# EAGLE design Annealer PCB (EAGLE 9.6.2)

## Sheet 1 of 2
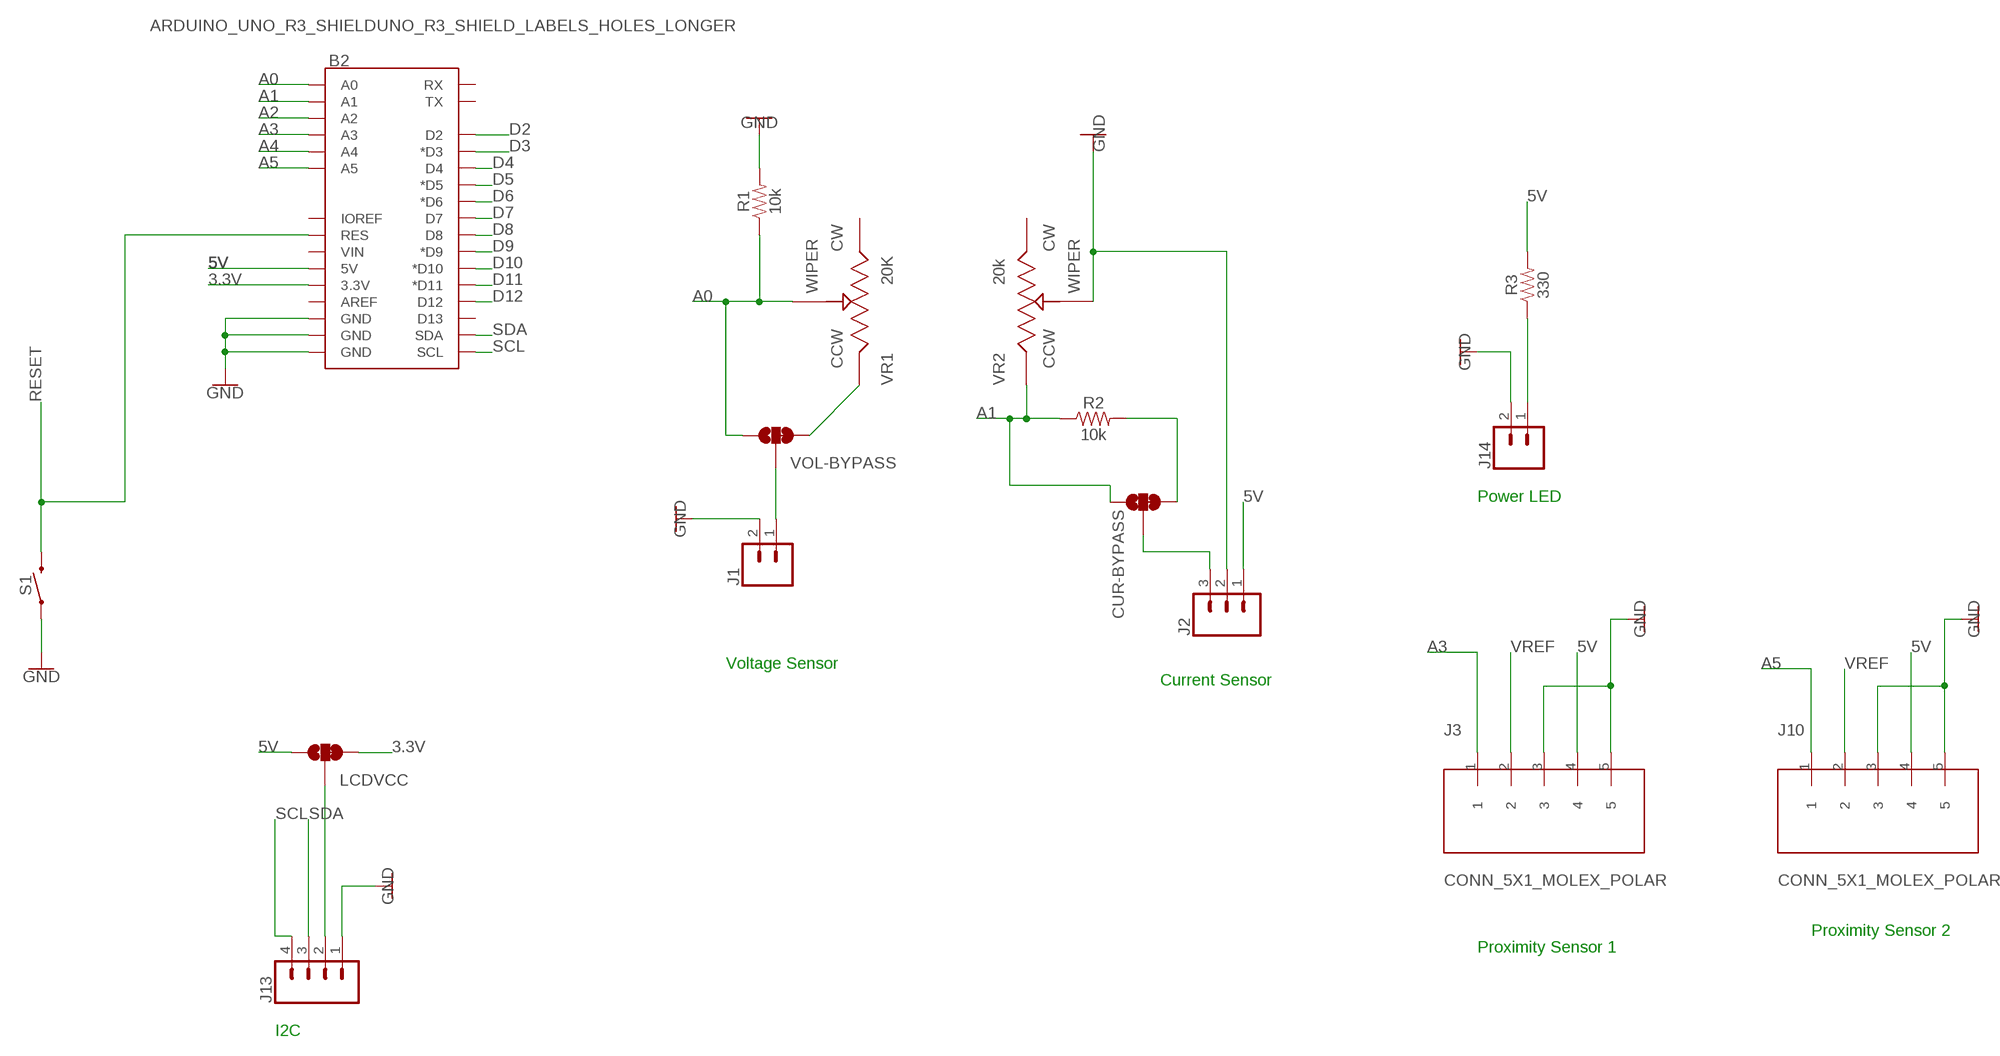
[diagram p0: schematic, sheet 1]

### Parts
B2  ARDUINO_UNO_R3_SHIELDUNO_R3_SHIELD_LABELS_HOLES_LONGER  [UNO_R3_SHIELD_HOLES_LONGER]
CUR-BYPASS  JUMPER-SMT_3_1-NC_TRACE_SILK  [SMT-JUMPER_3_1-NC_TRACE_SILK]
J1  CONN_02POLAR  [MOLEX-1X2]
J2  CONN_03POLAR  [MOLEX-1X3]
J3  CONN_5X1_MOLEX_POLAR  [MOLEX-5]
J10  CONN_5X1_MOLEX_POLAR  [MOLEX-5]
J13  CONN_04POLAR  [MOLEX-1X4]
J14  CONN_02POLAR  [MOLEX-1X2]
LCDVCC  JUMPER-SMT_3_1-NC_TRACE_SILK  [SMT-JUMPER_3_1-NC_TRACE_SILK]
R1  10k  10KOHM-HORIZ-1/4W-1%  [AXIAL-0.3]
R2  10k  10KOHM-HORIZ-1/4W-1%  [AXIAL-0.3]
R3  330  330OHM-HORIZ-1/10W-5%  [AXIAL-0.3]
S1  MOMENTARY-SWITCH-SPST-PTH-6.0MM  [TACTILE_SWITCH_PTH_6.0MM]
VOL-BYPASS  JUMPER-SMT_3_1-NC_TRACE_SILK  [SMT-JUMPER_3_1-NC_TRACE_SILK]
VR1  20K  3296W-1-103LF  [W]
VR2  20k  3296W-1-103LF  [W]

### Nets
3.3V: B2.3.3V LCDVCC.3 ; also sheet 2
5V: B2.5V J2.1 J3.4 J10.4 LCDVCC.1 R3.P$2 ; also sheet 2
A0: B2.A0 R1.P$1 VOL-BYPASS.1 VR1.2
A1: B2.A1 CUR-BYPASS.1 R2.P$1 VR2.1
A2: B2.A2 ; also sheet 2
A3: B2.A3 J3.1
A4: B2.A4 ; also sheet 2
A5: B2.A5 J10.1
D2: B2.D2 ; also sheet 2
D3: B2.D3(*D3) ; also sheet 2
D4: B2.D4 ; also sheet 2
D5: B2.D5(*D5) ; also sheet 2
D6: B2.D6(*D6) ; also sheet 2
D7: B2.D7 ; also sheet 2
D8: B2.D8 ; also sheet 2
D9: B2.D9(*D9) ; also sheet 2
D10: B2.D10(*D10) ; also sheet 2
D11: B2.D11(*D11) ; also sheet 2
D12: B2.D12 ; also sheet 2
GND: B2.GND@0(GND) B2.GND@1(GND) B2.GND@2(GND) J1.2 J2.2 J3.3 J3.5 J10.3 J10.5 J13.1 J14.2 R1.P$2 S1.1 VR2.2 ; also sheet 2
N$1: J14.1 R3.P$1
N$2: CUR-BYPASS.2 J2.3
N$3: CUR-BYPASS.3 R2.P$2
N$4: VOL-BYPASS.3 VR1.1
N$5: J1.1 VOL-BYPASS.2
N$12: J13.2 LCDVCC.2
RESET: B2.RES S1.3
SCL: B2.SCL J13.4
SDA: B2.SDA J13.3
VREF: J3.2 J10.2 ; also sheet 2
Unconnected: B2.AREF B2.D13 B2.IOREF B2.RX B2.TX B2.VIN VR1.3 VR2.3

### Notes on the sheet
- Power LED
- Voltage Sensor
- Current Sensor
- Proximity Sensor 2
- Proximity Sensor 1
- I2C

## Sheet 2 of 2
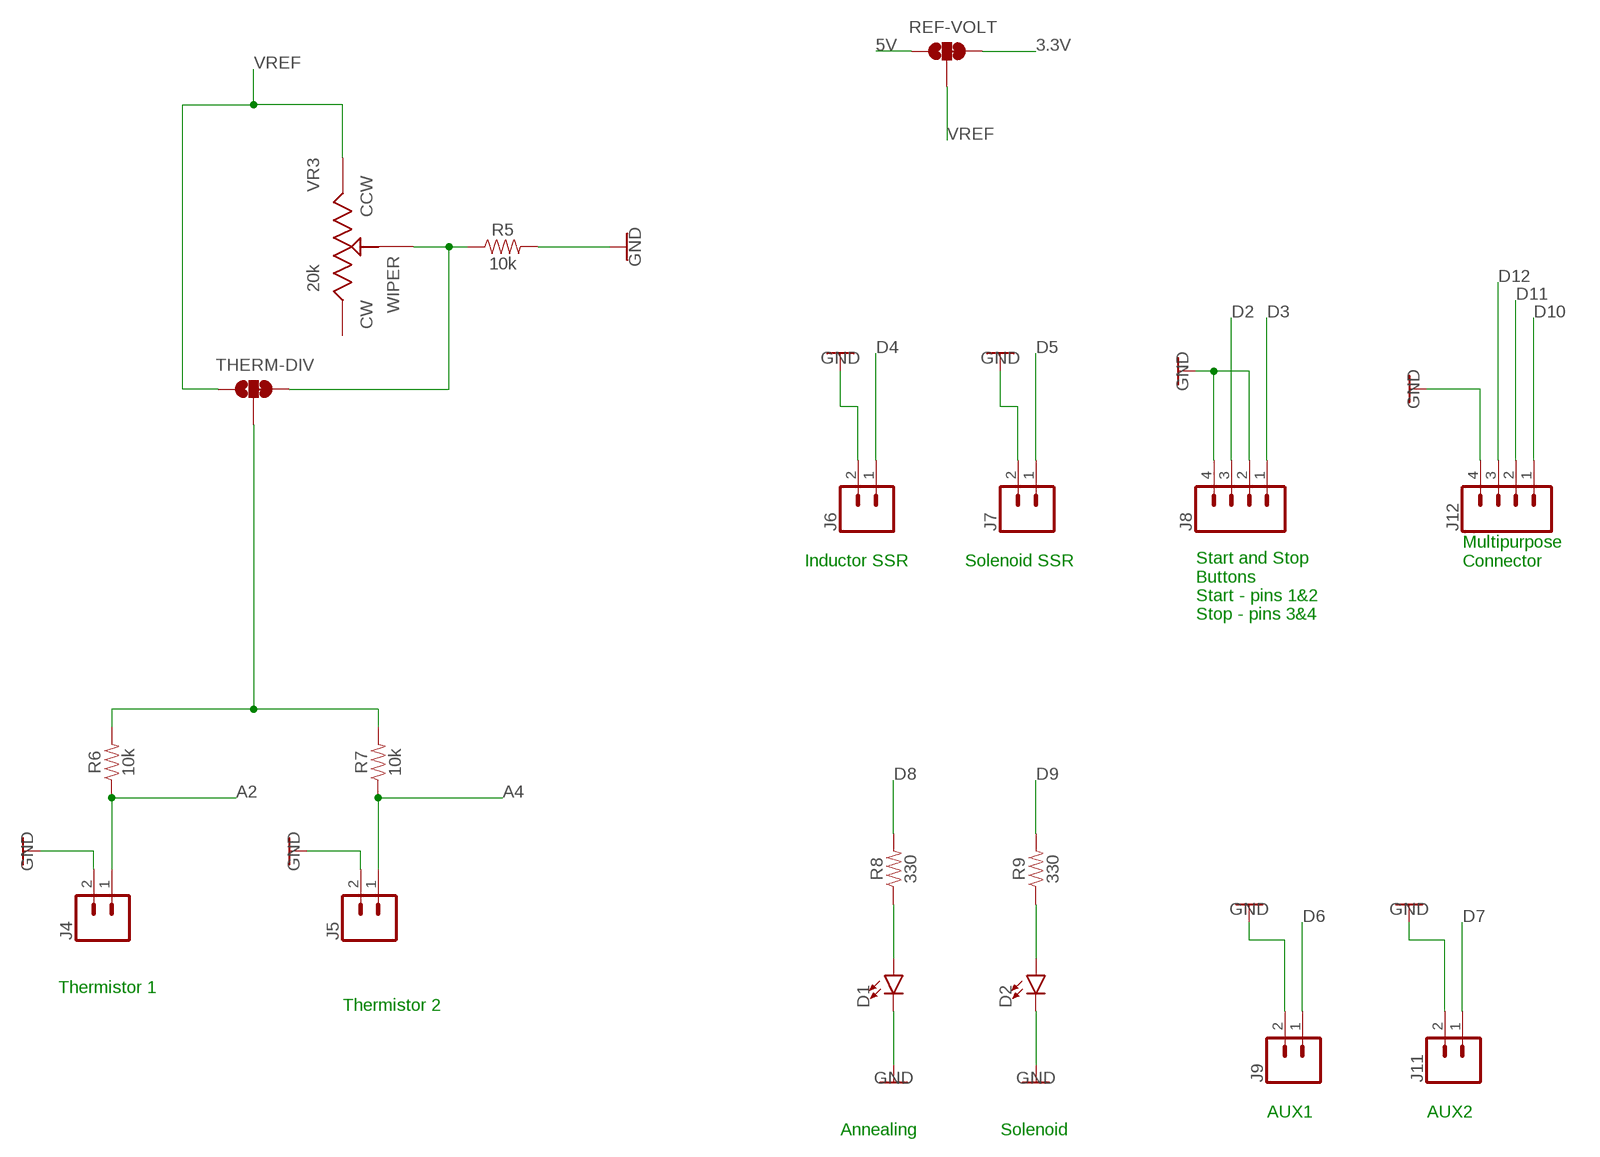
[diagram p1: schematic, sheet 2]

### Parts
D1  LED5MM  [LED_5MM]
D2  LED5MM  [LED_5MM]
J4  CONN_02POLAR  [MOLEX-1X2]
J5  CONN_02POLAR  [MOLEX-1X2]
J6  CONN_02POLAR  [MOLEX-1X2]
J7  CONN_02POLAR  [MOLEX-1X2]
J8  CONN_04POLAR  [MOLEX-1X4]
J9  CONN_02POLAR  [MOLEX-1X2]
J11  CONN_02POLAR  [MOLEX-1X2]
J12  CONN_04POLAR  [MOLEX-1X4]
R5  10k  10KOHM-HORIZ-1/4W-1%  [AXIAL-0.3]
R6  10k  10KOHM-HORIZ-1/4W-1%  [AXIAL-0.3]
R7  10k  10KOHM-HORIZ-1/4W-1%  [AXIAL-0.3]
R8  330  330OHM-HORIZ-1/10W-5%  [AXIAL-0.3]
R9  330  330OHM-HORIZ-1/10W-5%  [AXIAL-0.3]
REF-VOLT  JUMPER-SMT_3_1-NC_TRACE_SILK  [SMT-JUMPER_3_1-NC_TRACE_SILK]
THERM-DIV  JUMPER-SMT_3_1-NC_TRACE_SILK  [SMT-JUMPER_3_1-NC_TRACE_SILK]
VR3  20k  3296W-1-103LF  [W]

### Nets
3.3V: REF-VOLT.3 ; also sheet 1
5V: REF-VOLT.1 ; also sheet 1
A2: J4.1 R6.P$1 ; also sheet 1
A4: J5.1 R7.P$1 ; also sheet 1
D2: J8.3 ; also sheet 1
D3: J8.1 ; also sheet 1
D4: J6.1 ; also sheet 1
D5: J7.1 ; also sheet 1
D6: J9.1 ; also sheet 1
D7: J11.1 ; also sheet 1
D8: R8.P$2 ; also sheet 1
D9: R9.P$2 ; also sheet 1
D10: J12.1 ; also sheet 1
D11: J12.2 ; also sheet 1
D12: J12.3 ; also sheet 1
GND: D1.K(C) D2.K(C) J4.2 J5.2 J6.2 J7.2 J8.2 J8.4 J9.2 J11.2 J12.4 R5.P$2 ; also sheet 1
N$7: D1.A R8.P$1
N$9: D2.A R9.P$1
N$10: R5.P$1 THERM-DIV.3 VR3.2
SRC: R6.P$2 R7.P$2 THERM-DIV.2
VREF: REF-VOLT.2 THERM-DIV.1 VR3.1 ; also sheet 1
Unconnected: VR3.3

### Notes on the sheet
- Inductor SSR | Solenoid SSR
- Multipurpose
  Connector
- Start and Stop
  Buttons
  Start - pins 1&2
  Stop - pins 3&4
- Thermistor 1
- Thermistor 2
- AUX1 | AUX2
- Annealing | Solenoid

## Library data of the parts
B2 = dave-shields:ARDUINO_UNO_R3_SHIELD: Arduino R3 Shield Footprint Shield form compatible with the Arduino Uno R3. SparkFun Products: MG2639 Cellular Shield <https://www.sparkfun.com/products/13120> MIDI Shield <https://www.sparkfun.com/products/12898> R3 Stackable Headers Kit <https://www.sparkfun.com/products/11417>
CUR-BYPASS LCDVCC REF-VOLT THERM-DIV VOL-BYPASS = SparkFun-Jumpers:JUMPER-SMT_3_1-NC_TRACE: Normally closed trace jumper (1 of 2 connections) This jumper has a trace between two pads so it's normally closed (NC). The other connection is normally open (NO). Use a razor knife to open the connection. For best results follow the IPC guidelines for cutting traces: Cutout at least 0.063 mm (0.005 in). Remove all loose material to clean up the cut area. Seal the cut with an approved epoxy. Reapply solder to reclose the connection, or to close the NO connection.
D1 D2 = SparkFun-LED:LED: LED (Generic) Standard schematic elements and footprints for 5mm, 3mm, 1206, and 0603 sized LEDs. Generic LEDs with no color specified.
J1 J4-J7 J9 J11 J14 = SparkFun-Connectors:CONN_02: Multi connection point. Often used as Generic Header-pin footprint for 0.1 inch spaced/style header connections On any of the 0.1 inch spaced packages, you can populate with these: Break Away Headers - Straight <https://www.sparkfun.com/products/116> (PRT-00116) Break Away Male Headers - Right Angle <https://www.sparkfun.com/products/553> (PRT-00553) Female Headers <https://www.sparkfun.com/products/115> (PRT-00115) Break Away Headers - Machine Pin <https://www.sparkfun.com/products/117> (PRT-00117) Break Away Female Headers - Swiss Machine Pin <https://www.sparkfun.com/products/743> (PRT-00743) For SCREWTERMINALS and SPRING TERMINALS visit here: Screw Terimnals on SparkFun.com <https://www.sparkfun.com/search/results?term=Screw+Terminals> (5mm/3.5mm/2.54mm spacing) This device is also useful as a general connection point to wire up your design to another part of your project. Our various solder wires solder well into these plated through hole pads. Hook-Up Wire - Assortment (Stranded, 22 AWG) <https://www.sparkfun.com/products/11375> (PRT-11375) Hook-Up Wire - Assortment (Solid Core, 22 AWG) <https://www.sparkfun.com/products/11367> (PRT-11367) View the entire wire category on our website here <https://www.sparkfun.com/categories/141> Special notes: Molex polarized connector foot print use with: PRT-08233 with associated crimp pins and housings. 2.54_SCREWTERM for use with PRT-10571. 3.5mm Screw Terminal footprints for PRT-08084 5mm Screw Terminal footprints for use with PRT-08432; SF_ID: PRT-09918
J2 = SparkFun-Connectors:CONN_03: Multi connection point. Often used as Generic Header-pin footprint for 0.1 inch spaced/style header connections On any of the 0.1 inch spaced packages, you can populate with these: Break Away Headers - Straight <https://www.sparkfun.com/products/116> (PRT-00116) Break Away Male Headers - Right Angle <https://www.sparkfun.com/products/553> (PRT-00553) Female Headers <https://www.sparkfun.com/products/115> (PRT-00115) Break Away Headers - Machine Pin <https://www.sparkfun.com/products/117> (PRT-00117) Break Away Female Headers - Swiss Machine Pin <https://www.sparkfun.com/products/743> (PRT-00743) Stackable Header - 3 Pin (Female, 0.1") <https://www.sparkfun.com/products/13875> (PRT-13875) For SCREWTERMINALS and SPRING TERMINALS visit here: Screw Terimnals on SparkFun.com <https://www.sparkfun.com/search/results?term=Screw+Terminals> (5mm/3.5mm/2.54mm spacing) This device is also useful as a general connection point to wire up your design to another part of your project. Our various solder wires solder well into these plated through hole pads. Hook-Up Wire - Assortment (Stranded, 22 AWG) <https://www.sparkfun.com/products/11375> (PRT-11375) Hook-Up Wire - Assortment (Solid Core, 22 AWG) <https://www.sparkfun.com/products/11367> (PRT-11367) View the entire wire category on our website here <https://www.sparkfun.com/categories/141> Special notes: Molex polarized connector foot print use with SKU : PRT-08232 with associated crimp pins and housings.; PROD_ID: CONN-08625; SF_ID: PRT-08096
J3 J10 = dave-connectors:CONN_5X1_MOLEX_POLAR
J8 J12 J13 = SparkFun-Connectors:CONN_04: Multi connection point. Often used as Generic Header-pin footprint for 0.1 inch spaced/style header connections On any of the 0.1 inch spaced packages, you can populate with these: Break Away Headers - Straight <https://www.sparkfun.com/products/116> (PRT-00116) Break Away Male Headers - Right Angle <https://www.sparkfun.com/products/553> (PRT-00553) Female Headers <https://www.sparkfun.com/products/115> (PRT-00115) Break Away Headers - Machine Pin <https://www.sparkfun.com/products/117> (PRT-00117) Break Away Female Headers - Swiss Machine Pin <https://www.sparkfun.com/products/743> (PRT-00743) For SCREWTERMINALS and SPRING TERMINALS visit here: Screw Terimnals on SparkFun.com <https://www.sparkfun.com/search/results?term=Screw+Terminals> (5mm/3.5mm/2.54mm spacing) This device is also useful as a general connection point to wire up your design to another part of your project. Our various solder wires solder well into these plated through hole pads. Hook-Up Wire - Assortment (Stranded, 22 AWG) <https://www.sparkfun.com/products/11375> (PRT-11375) Hook-Up Wire - Assortment (Solid Core, 22 AWG) <https://www.sparkfun.com/products/11367> (PRT-11367) View the entire wire category on our website here <https://www.sparkfun.com/categories/141> Special notes: Molex polarized connector foot print use with SKU : PRT-08231 with associated crimp pins and housings. 1MM SMD Version SKU: PRT-10208; PROD_ID: CONN-08186; SF_ID: PRT-08231
R1 R2 R5-R7 = SparkFun-Resistors:10KOHM: 10kΩ resistor A resistor is a passive two-terminal electrical component that implements electrical resistance as a circuit element. Resistors act to reduce current flow, and, at the same time, act to lower voltage levels within circuits. - Wikipedia; PROD_ID: RES-12183
R3 R8 R9 = SparkFun-Resistors:330OHM: 330Ω resistor A resistor is a passive two-terminal electrical component that implements electrical resistance as a circuit element. Resistors act to reduce current flow, and, at the same time, act to lower voltage levels within circuits. - Wikipedia; PROD_ID: RES-8371
S1 = SparkFun-Switches:MOMENTARY-SWITCH-SPST: Momentary Switch (Pushbutton) - SPST Normally-open (NO) SPST momentary switches (buttons, pushbuttons). Variants PTH-12MM - 12mm square, through-hole Momentary Pushbutton Switch - 12mm Square <https://www.sparkfun.com/products/9190> (COM-09190) PTH-6.0MM, PTH-6.0MM-KIT - 6.0mm square, through-hole Mini Pushbutton Switch <https://www.sparkfun.com/products/97> (COM-00097) KIT package intended for soldering kit's - only one side of pads' copper is exposed. PTH-RIGHT-ANGLE-KIT - Right-angle, through-hole Right Angle Tactile Button <https://www.sparkfun.com/products/10791> - Used on SparkFun BigTime Watch Kit <https://www.sparkfun.com/products/11734> SMD-12MM - 12mm square, surface-mount Tactile Button - SMD (12mm) <https://www.sparkfun.com/products/12993> (COM-12993) Used on SparkFun PicoBoard <https://www.sparkfun.com/products/11888> SMD-4.5MM - 4.5mm Square Trackball Switch Used on SparkFun Blackberry Trackballer Breakout <https://www.sparkfun.com/products/13169> SMD-4.6MMX2.8MM - 4.60mm x 2.80mm, surface mount Used on SparkFun SAMD21 Mini Breakout <https://www.sparkfun.com/products/13664> SMD-5.2MM, SMD-5.2-REDUNDANT - 5.2mm square, surface-mount Mini Pushbutton Switch - SMD <https://www.sparkfun.com/products/8720> (COM-08720) Used on Arduino Pro Mini <https://www.sparkfun.com/products/11114> REDUNDANT package connects both switch circuits together SMD-6.0X3.5MM - 6.0 x 3.5mm, surface mount Momentary Reset Switch SMD <https://www.sparkfun.com/products/8229> (COM-08229) SMD-6.2MM-TALL - 6.2mm square, surface mount Tactile Button - SMD (6mm) <https://www.sparkfun.com/products/12992> Used on SparkFun Digital Sandbox <https://www.sparkfun.com/products/12651> SMD-RIGHT-ANGLE - Right-angle, surface mount Used on SparkFun Block for Intel® Edison - Arduino <https://www.sparkfun.com/products/13036>; PROD_ID: SWCH-08441; SF_SKU: COM-00097
VR1-VR3 = Volks73-Bourns:3296?-*: Trim Potentiometer (Pot) Documentation Datasheet <http://www.bourns.com/data/global/pdfs/3296.pdf> Features Multiturn/Cermet/Industrial/Sealed 5 terminal styles Tape and reel packaging Chevron seal design Listed on the QPL for style RJ24 per MIL-R_22097 and RJR24 per High-Rel Mil-R-39035 Mounting hardware available (H-117P) RoHS compliant* version available For trimmer applications/processing guidelines, click here <http://www.bourns.com/data/global/pdfs/ap_proc.pdf>; ADJUSTMENT_TYPE: Tope Adjustment; CATEGORY: Potentiometers, Variable Resistors; DESCRIPTION: TRIMMER 10K OHM 0.5W PC PIN; DOCUMENTATION_LINK: <a href="http://www.bourns.com/data/global/pdfs/3296.pdf">Datasheet</a>; DOCUMENTATION_URL: http://www.bourns.com/data/global/pdfs/3296.pdf; FAMILY: Trimmer Potentiometers; MANUFACTURER: Bourns Inc; MOUNTING_TYPE: Through Hole; NUMBER_OF_TURNS: 25; PART_NUMBER: 3296W-1-103LF; POWER: 0.5W, 1/2W; RESISTANCE: 10k; RESISTIVE_MATERIAL: Cermet; SERIES: Trimpt 3296 - Sealed; SIZE: Rectangular - 0.375" x 0.190" Face x 0.395" H (9.53mm x 4.83mm x 10.03mm); STANDARD_PACKAGE: 50; SUPPLIER_ITEM_LINK: <a href="http://www.digikey.com/product-detail/en/3296W-1-103LF/3296W-103LF-ND/1088045">Details</a>; SUPPLIER_ITEM_NUMBER: 3296W-103LF-ND; SUPPLIER_ITEM_URL: http://www.digikey.com/product-detail/en/3296W-1-103LF/3296W-103LF-ND/1088045; SUPPLIER_LINK: <a href="http://www.digikey.com">Home Page</a>; SUPPLIER_NAME: Digi-Key; SUPPLIER_URL: http://www.digikey.com; TEMPERATURE_COEFFICIENT: 100ppm/C; TERMINATION_STYLE: PC Pin; TOLERANCE: 10%

## Net classes
1 power: width 0.254 mm, clearance 0.205 mm to class 0, clearance 0.205 mm

## Board
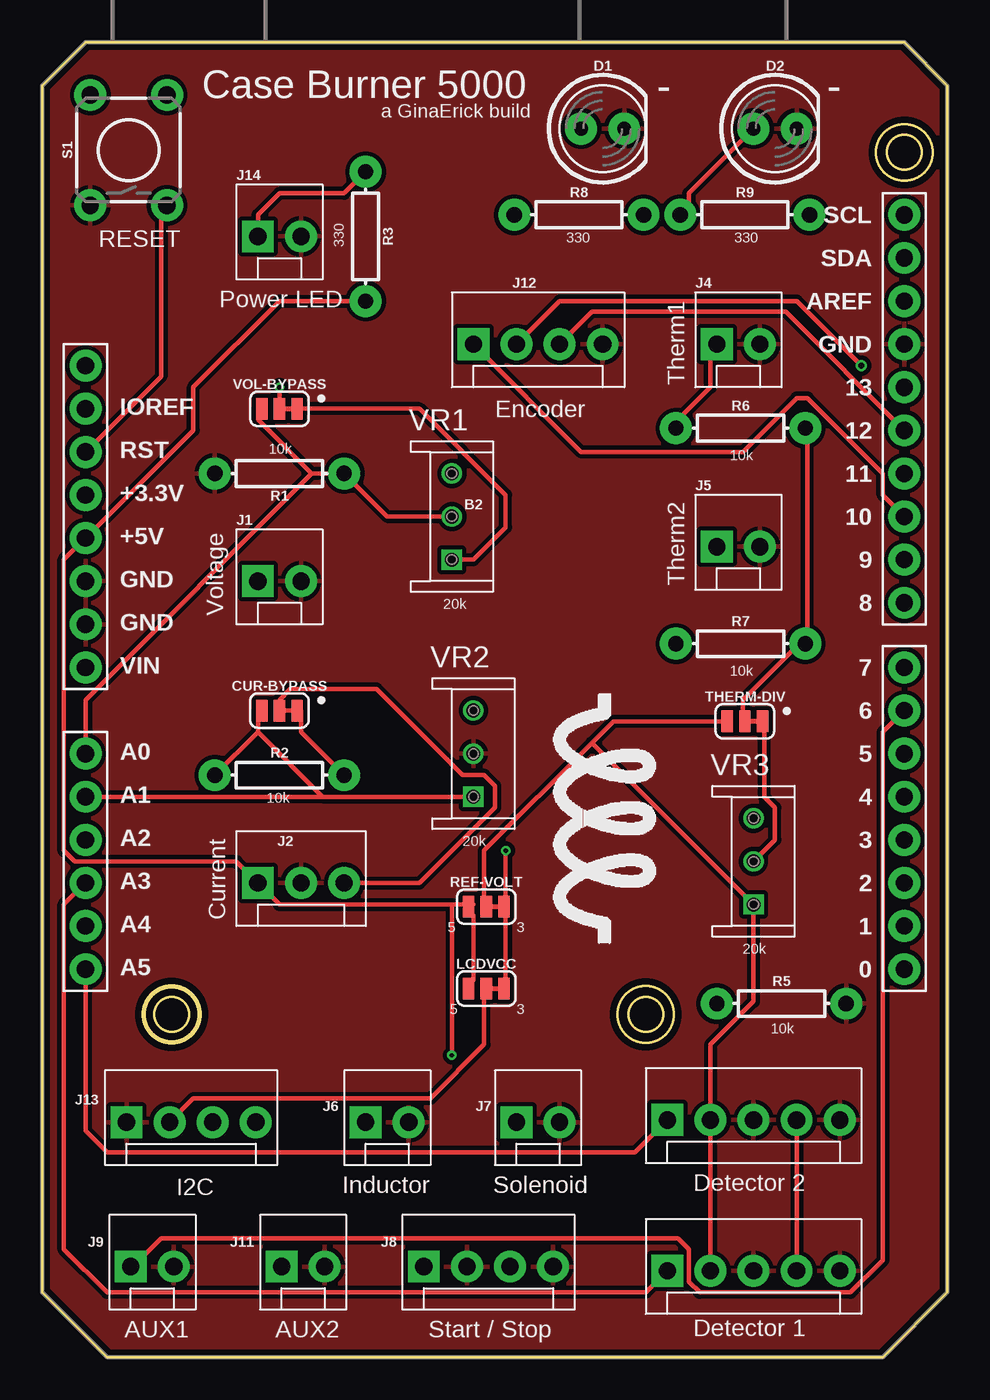
[diagram p2: board, top side]
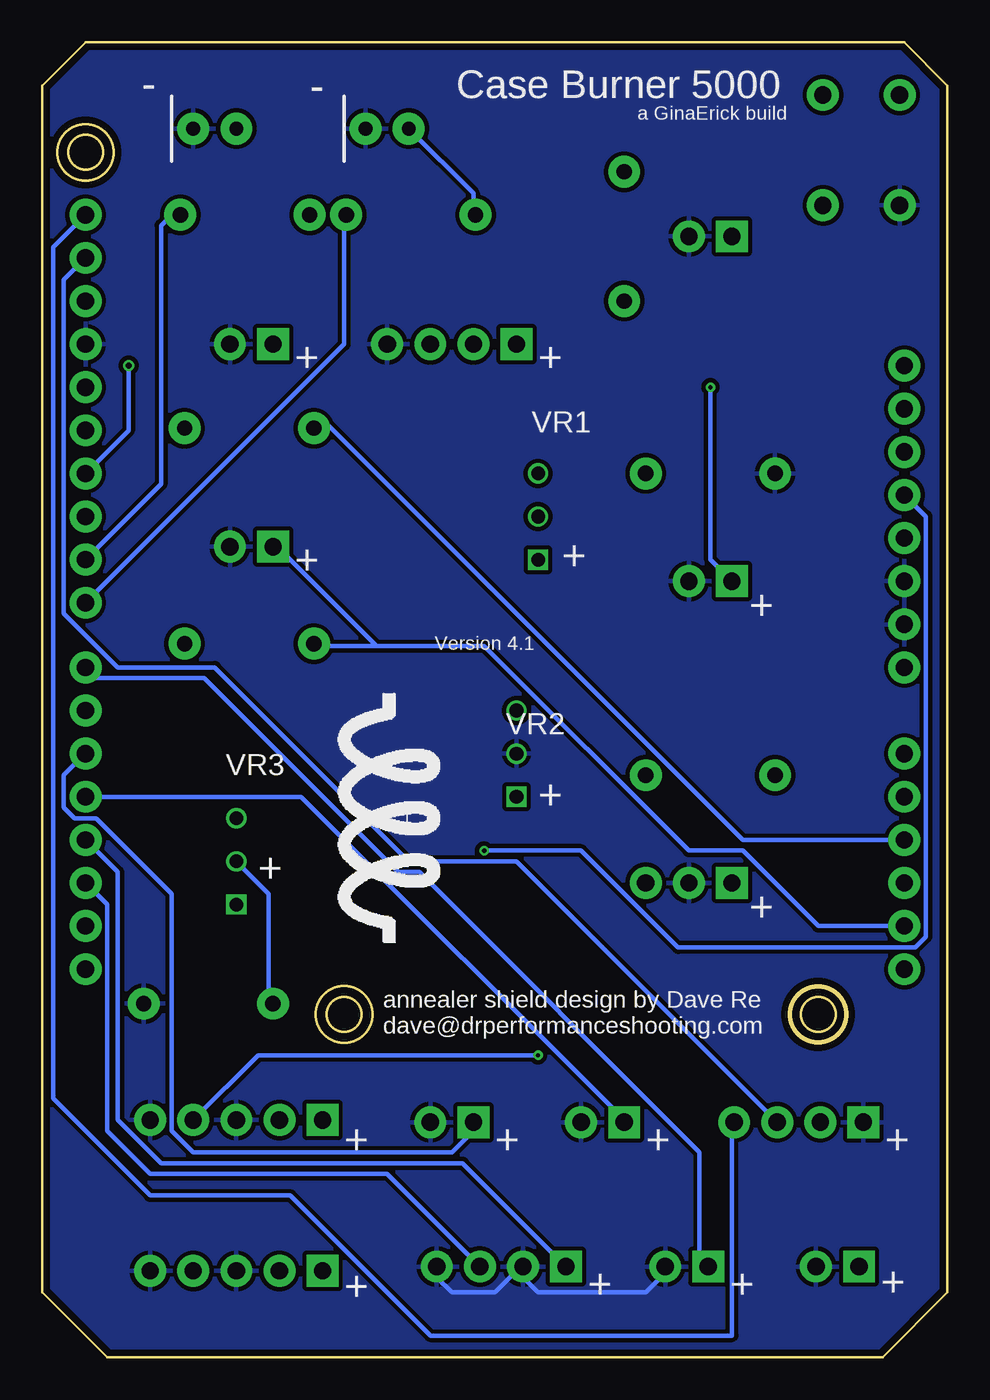
[diagram p3: board, bottom side, seen from below]

Size 53.34 x 77.47 mm. Coordinates in mm from the lower left corner, seen from the top.
Outline: 0,3.81 0,74.93 2.54,77.47 50.8,77.47 53.34,74.93 53.34,3.81 49.53,0 3.81,0 0,3.81
Outline: circle at 7.62,20.19 radius 1.65
Outline: circle at 35.56,20.19 radius 1.65
Outline: circle at 50.8,70.99 radius 1.65
Copper layers (1*16): Top 0.035559375mm / dielectric 1.6mm / Bottom 0.035559375mm
Design rules "oshpark-2layer-auto-routing": minimum track width 10mil, minimum drill 10mil, track to track 10mil, track to pad 8mil, pad to pad 8mil, via to via 8mil, smd to smd 6mil, copper to edge 15mil, drill to drill 6mil, minimum pad ring 6mil, minimum via ring 6mil, stop-mask expansion 2.5mil, vias tented up to drill 0mil, thermal gap 10mil

### Footprints (pad centres in the part's own frame; a part is rotated, then mirrored left to right if it is on the bottom)
UNO_R3_SHIELD_HOLES_LONGER = drill 1.016 pad 1.88: 3.3V 22.86,-1.27; 5V 22.86,1.27; A0 22.86,13.97; A1 22.86,16.51; A2 22.86,19.05; A3 22.86,21.59; A4 22.86,24.13; A5 22.86,26.67; AREF -25.4,-12.7; D2 -25.4,21.59; D3 -25.4,19.05; D4 -25.4,16.51; D5 -25.4,13.97; D6 -25.4,11.43; D7 -25.4,8.89; D8 -25.4,5.08; D9 -25.4,2.54; D10 -25.4,0; D11 -25.4,-2.54; D12 -25.4,-5.08; D13 -25.4,-7.62; GND@0 22.86,3.81; GND@1 22.86,6.35; GND@2 -25.4,-10.16; IOREF 22.86,-6.35; NC 22.86,-8.89; RES 22.86,-3.81; RX -25.4,26.67; SCL -25.4,-17.78; SDA -25.4,-15.24; TX -25.4,24.13; VIN 22.86,8.89
SMT-JUMPER_3_1-NC_TRACE_SILK = smd 0.66 x 1.27: 1 -1.041,0; 2 0,0; 3 1.041,0
LED_5MM = drill 0.813 pad 1.88: A -1.27,0; K 1.27,0
MOLEX-1X2 = drill 1.016 pad 1.88 square: 1 0,0 | drill 1.016 pad 1.88: 2 2.54,0
MOLEX-1X3 = drill 1.016 pad 1.88 square: 1 0,0 | drill 1.016 pad 1.88: 2 2.54,0; 3 5.08,0
MOLEX-5 = drill 1.016 pad 1.88 square: 1 0,0 | drill 1.016 pad 1.88: 2 2.54,0; 3 5.08,0; 4 7.62,0; 5 10.16,0
MOLEX-1X4 = drill 1.016 pad 1.88 square: 1 0,0 | drill 1.016 pad 1.88: 2 2.54,0; 3 5.08,0; 4 7.62,0
AXIAL-0.3 = drill 0.9 pad 1.88: P$1 -3.81,0; P$2 3.81,0
TACTILE_SWITCH_PTH_6.0MM = drill 1.016 pad 1.88: 1 -3.251,2.261; 2 3.251,2.261; 3 -3.251,-2.261; 4 3.251,-2.261
W = drill 0.8 square: 1 0,-2.54 | drill 0.8: 2 0,0; 3 0,2.54

### Placement (x,y rotation side)
B2  25.4,49.53 180 top
CUR-BYPASS  13.97,38.1 0 top
D1  33.02,72.39 0 top
D2  43.18,72.39 0 top
J1  12.7,45.72 0 top
J2  12.7,27.94 0 top
J3  36.83,5.08 0 top
J4  39.75,59.69 0 top
J5  39.75,47.75 0 top
J6  19.05,13.84 0 top
J7  27.94,13.84 0 top
J8  22.48,5.33 0 top
J9  5.21,5.33 0 top
J10  36.83,13.97 0 top
J11  14.1,5.33 0 top
J12  25.4,59.69 0 top
J13  4.95,13.84 0 top
J14  12.7,66.04 0 top
LCDVCC  26.16,21.72 0 top
R1  13.97,52.07 180 top
R2  13.97,34.29 0 top
R3  19.05,66.04 270 top
R5  43.56,20.83 0 top
R6  41.15,54.74 0 top
R7  41.15,42.04 0 top
R8  31.62,67.31 0 top
R9  41.4,67.31 0 top
REF-VOLT  26.16,26.54 0 top
S1  5.08,71.12 90 top
THERM-DIV  41.4,37.47 0 top
VOL-BYPASS  13.97,55.88 0 top
VR1  24.13,49.53 0 top
VR2  25.4,35.56 0 top
VR3  41.91,29.21 0 top

### Tracks (layer width: path | path; a pad name or v marks a point on that pad's centre or on a via)
3.3V  (via drill 0.25)
  Top 0.254: LCDVCC.3 27.3,22.23 27.3,26.04 REF-VOLT.3 27.3,26.67 v27.3,29.84
  Bottom 0.254: v27.3,29.84 21.59,29.84 15.88,24.13 1.9,24.13 1.27,24.77 1.27,49.53 B2.3.3V
5V  (via drill 0.25)
  Top 0.254: J10.4 J3.4 | LCDVCC.1 25.4,22.23 25.4,26.04 REF-VOLT.1 25.4,26.67 24.13,26.67 | 24.13,26.67 13.97,26.67 J2.1 11.43,29.21 1.9,29.21 1.27,29.84 1.27,46.99 B2.5V 8.89,54.61 8.89,57.15 13.97,62.23 R3.P$2 | 24.13,26.67 v24.13,17.78
  Bottom 0.254: J10.4 40.64,17.78 v24.13,17.78
A0
  Top 0.254: 15.88,52.07 12.7,55.24 12.7,55.88 VOL-BYPASS.1 | 15.88,52.07 R1.P$1 20.32,49.53 VR1.2 | B2.A0 2.54,38.73 15.88,52.07
A1
  Top 0.254: 12.7,36.83 12.7,38.1 CUR-BYPASS.1 | R2.P$1 12.7,36.83 | 16.51,33.02 VR2.1 | 12.7,36.83 16.51,33.02 | 16.51,33.02 B2.A1
A2
  Top 0.254: J4.1 39.37,59.69 39.37,57.15 37.46,55.24 R6.P$1
  Bottom 0.254: B2.A2 12.06,30.48 36.83,55.24 R6.P$1
A3
  Top 0.254: B2.A3 1.27,26.67 1.27,6.35 3.81,3.81 35.56,3.81 J3.1
A4
  Bottom 0.254: B2.A4 7.62,25.4 12.06,29.84 15.24,29.84 27.3,41.91 33.66,41.91 | 33.66,41.91 36.83,41.91 R7.P$1 | 33.66,41.91 39.37,47.62 J5.1
A5
  Top 0.254: B2.A5 2.54,13.34 3.81,12.07 34.92,12.07 J10.1
D2
  Bottom 0.254: J8.3 33.02,10.8 46.99,10.8 49.53,13.34 49.53,26.67 B2.D2
D3
  Bottom 0.254: J8.1 28.58,11.43 46.35,11.43 48.89,13.97 48.89,28.57 B2.D3
D4
  Bottom 0.254: B2.D4 38.1,33.02 19.05,13.97 J6.1
D5
  Bottom 0.254: B2.D5 52.07,34.29 52.07,32.38 51.44,31.75 50.16,31.75 45.72,27.3 45.72,13.34 44.45,12.07 29.21,12.07 27.94,13.34 J7.1
D6
  Top 0.254: B2.D6 49.53,36.83 49.53,5.72 47.62,3.81 38.73,3.81 38.1,4.45 38.1,6.35 37.46,6.99 6.98,6.99 5.71,5.72 J9.1
D7
  Bottom 0.254: B2.D7 50.16,40.01 43.81,40.01 32.38,28.57 31.12,28.57 14.61,12.07 14.61,5.72 J11.1
D8
  Bottom 0.254: B2.D8 35.56,59.69 35.56,67.31 R8.P$2
D9
  Bottom 0.254: B2.D9 46.35,51.44 46.35,66.67 45.72,67.31 R9.P$2
D10
  Top 0.254: J12.1 31.75,53.34 41.27,53.34 44.45,56.52 45.09,56.52 49.53,52.07 49.53,50.8 B2.D10
D11  (via drill 0.35)
  Top 0.254: J12.2 30.48,62.23 44.45,62.23 v48.26,58.42
  Bottom 0.254: v48.26,58.42 48.26,54.61 B2.D11
D12
  Top 0.254: J12.3 32.38,61.6 43.81,61.6 B2.D12
GND
  Bottom 0.254: J8.4 30.1,4.7 29.21,3.81 26.67,3.81 25.4,5.08 24.13,3.81 17.78,3.81 16.64,4.95 J11.2
  pour Bottom: 0,74.93 2.54,77.47 50.8,77.47 53.34,74.93 53.34,3.81 49.53,0 3.81,0 0,3.81
  pour Top: 0,74.93 2.54,77.47 50.8,77.47 53.34,74.93 53.34,3.81 49.53,0 3.81,0 0,3.81
N$1
  Top 0.254: R3.P$1 17.78,68.58 13.97,68.58 12.7,67.31 J14.1
N$2
  Top 0.254: CUR-BYPASS.2 13.97,38.73 14.61,39.37 19.68,39.37 24.77,34.29 26.03,34.29 26.67,33.66 26.67,32.38 22.22,27.94 J2.3
N$3
  Top 0.254: R2.P$2 15.24,36.83 15.24,38.1 CUR-BYPASS.3
N$4
  Top 0.254: VOL-BYPASS.3 22.22,55.88 27.3,50.8 27.3,48.9 25.4,46.99 VR1.1
N$5  (via drill 0.25)
  Top 0.254: v13.97,57.15 VOL-BYPASS.2
  Bottom 0.254: v13.97,57.15 13.97,46.99 J1.1
N$7
  Bottom 0.254: D1.A 27.94,68.58 27.94,67.31 R8.P$1
N$9
  Top 0.254: D2.A 38.1,68.58 38.1,67.31 R9.P$1
N$10
  Top 0.254: VR3.2 43.18,30.48 43.18,32.38 42.55,33.02 42.55,37.47 THERM-DIV.3
  Bottom 0.254: VR3.2 40.01,27.3 40.01,20.96 R5.P$1
N$12
  Top 0.254: J13.2 8.89,15.24 22.86,15.24 26.03,18.41 26.03,21.59 LCDVCC.2
RESET
  Top 0.254: B2.RES 6.98,57.79 6.98,67.31 S1.3
SCL
  Bottom 0.254: B2.SCL 52.7,65.4 52.7,15.24 46.99,9.52 38.73,9.52 30.48,1.27 12.7,1.27 12.7,13.34 J13.4
SDA
  Bottom 0.254: J13.3 25.4,29.21 31.75,29.21 43.18,40.64 48.89,40.64 52.07,43.81 52.07,63.5 B2.SDA
SRC
  Top 0.254: THERM-DIV.2 41.27,37.47 41.27,38.73 44.45,41.91 R7.P$2 45.09,42.55 45.09,54.61 R6.P$2
VREF
  Top 0.254: J3.2 J10.2 39.37,18.41 41.91,20.96 VR3.1 32.38,36.2 | 32.38,36.2 33.66,37.47 THERM-DIV.1 | 32.38,36.2 26.03,29.84 26.03,26.67 REF-VOLT.2

### Text on the board
tPlace: Case Burner 5000 | - | - | a GinaErick build | RESET | 330 | 330 | 330 | Power LED | Therm1 | • | Encoder | 10k | 10k | Therm2 | 20k | Voltage | 10k | • | • | 10k | 20k | Current | 5 | 3 | 20k | 5 | 3 | 10k | I2C | Inductor | Solenoid | Detector 2 | AUX1 | AUX2 | Start / Stop | Detector 1
bPlace: Case Burner 5000 | - | - | a GinaErick build | + | + | VR1 | + | + | + | Version 4.1 | VR2 | VR3 | + | + | + | annealer shield design by Dave Re / dave@drperformanceshooting.com | + | + | + | + | + | + | + | +